# EAGLE design Carte (EAGLE 5.11)
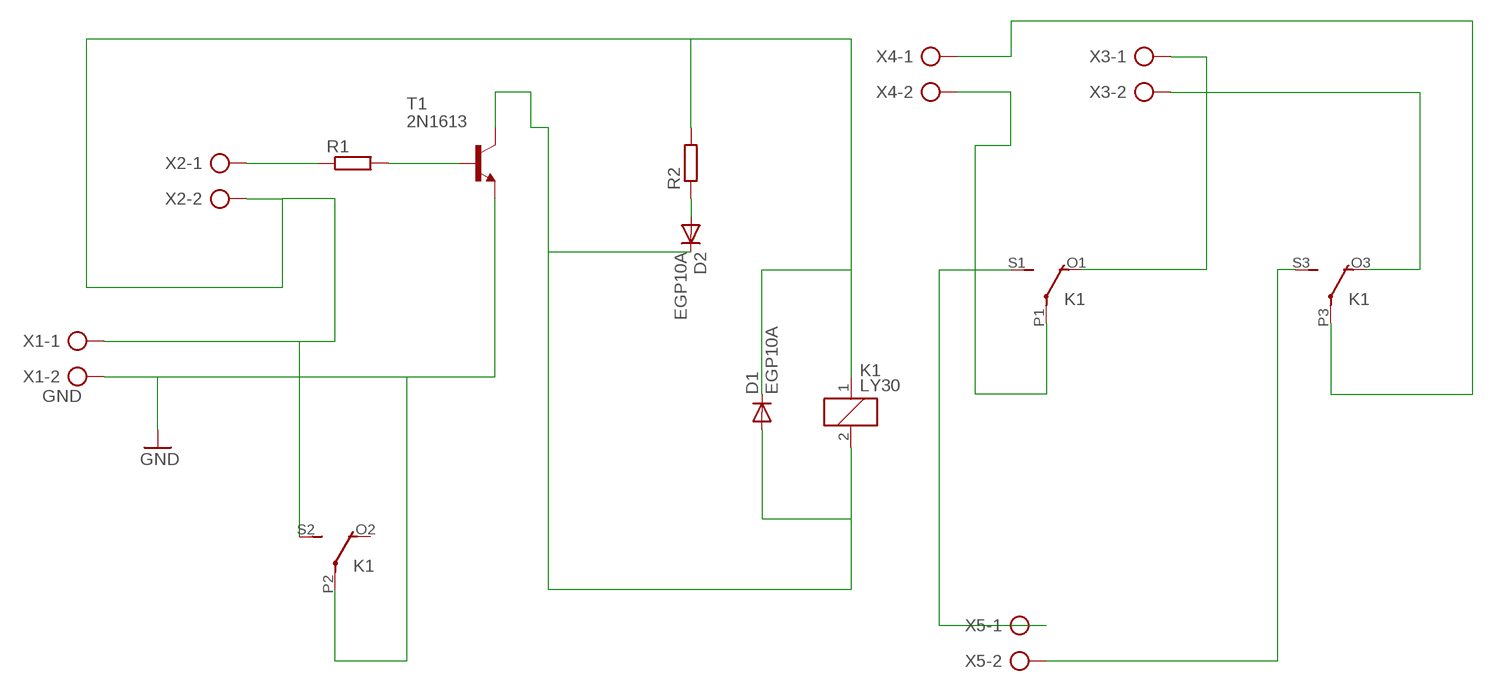
[diagram p0: schematic, sheet 1]

## Parts
D1  EGP10A  [DO41-10]
D2  EGP10A  [DO41-10]
K1  LY30  [LY30]
R1  R-EU_0309/10  [0309/10]
R2  R-EU_0309/10  [0309/10]
T1  2N1613  [TO5]
X1  GND  AK300/2  [AK300/2]
X2  AK300/2  [AK300/2]
X3  AK300/2  [AK300/2]
X4  AK300/2  [AK300/2]
X5  AK300/2  [AK300/2]

## Nets
GND: K1.P2(3:P) T1.1(E) X1.2
N$1: D1.C K1.1 K1.S2(3:S) R2.2 X1.1 X2.2
N$3: R1.1 X2.1
N$4: R1.2 T1.2(B)
N$5: K1.O3(4:O) X3.2
N$6: D2.A R2.1
N$7: K1.S3(4:S) X5.2
N$8: K1.O1(2:O) X3.1
N$9: K1.P1(2:P) X4.2
N$10: D1.A D2.C K1.2 T1.3(C)
N$11: K1.P3(4:P) X4.1
N$12: K1.S1(2:S) X5.1
Unconnected: K1.O2(3:O)

## Library data of the parts
D1 D2 = diode:EGP10A: DIODE ultra fast-recovery rectifier
K1 = Relai ss-marin:LY30: RELAY 3 x switch, Omron; OC_FARNELL: unknown; OC_NEWARK: unknown
R1 R2 = resistor:R-EU_: RESISTOR, European symbol
T1 = transistor:2N1613: NPN TRANSISTOR
X1-X5 = con-ptr500:AK300/2: CONNECTOR; OC_FARNELL: unknown; OC_NEWARK: unknown

## Board
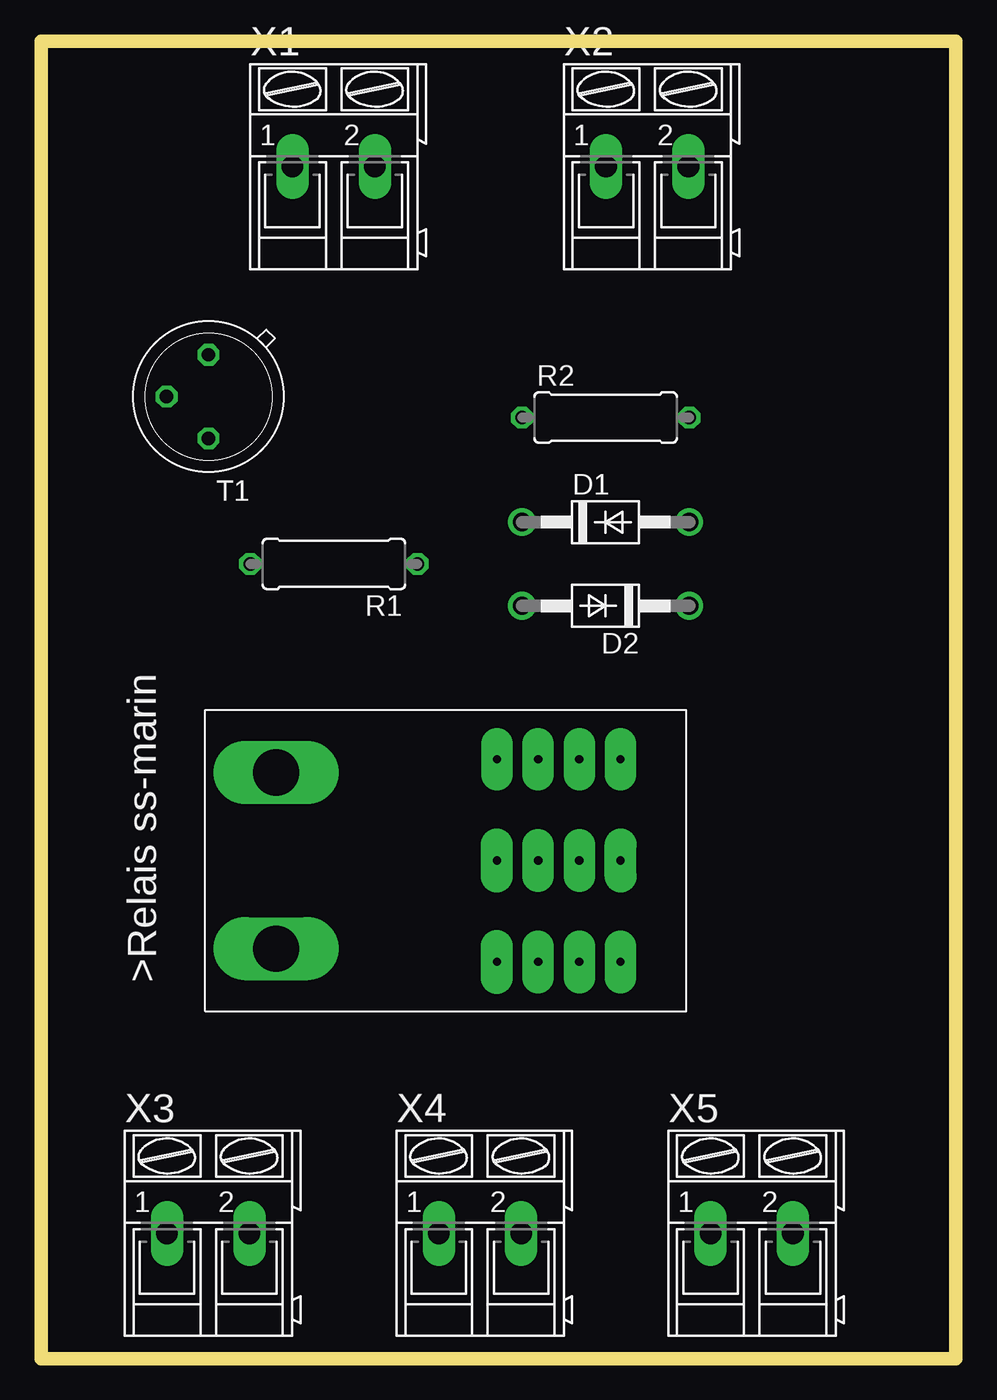
[diagram p1: board, top side]
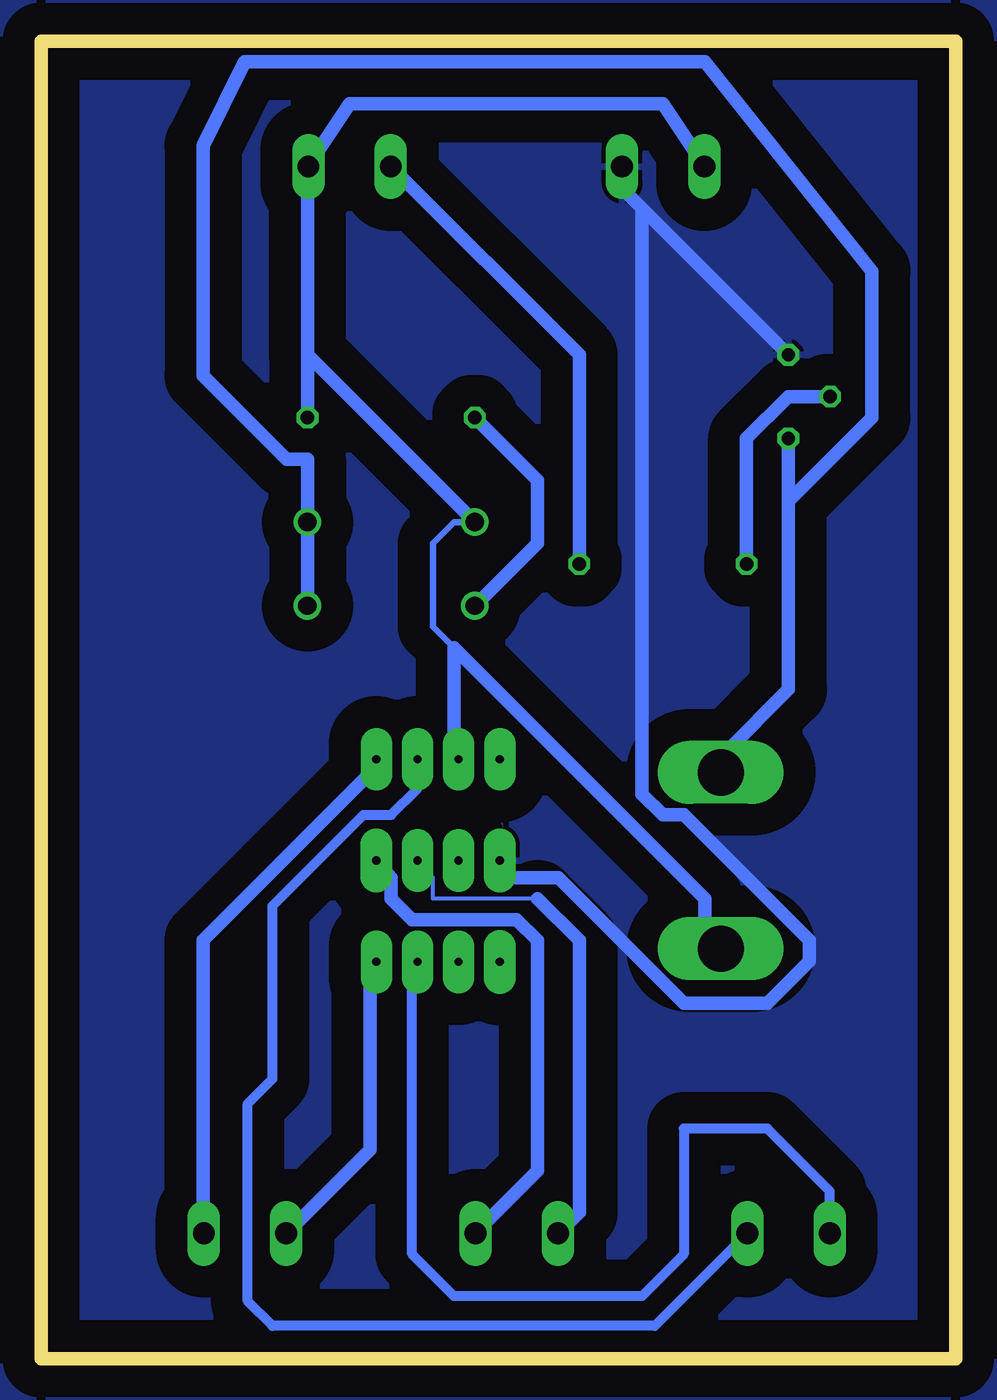
[diagram p2: board, bottom side, seen from below]

Size 55.55 x 80 mm. Coordinates in mm from the lower left corner, seen from the top.
Outline: 0,0 55.55,0 55.55,80 0,80 0,0
Copper layers (1*16): Top 0.035mm / dielectric 1.5mm / Bottom 0.035mm
Design rules "default": minimum track width 10mil, minimum drill 24mil, track to track 8mil, track to pad 8mil, pad to pad 8mil, via to via 8mil, smd to smd 8mil, copper to edge 40mil, drill to drill 8mil, minimum pad ring 10mil, minimum via ring 8mil, stop-mask expansion 4mil, vias tented up to drill 0mil, thermal gap 10mil

### Footprints (pad centres in the part's own frame; a part is rotated, then mirrored left to right if it is on the bottom)
DO41-10 = drill 1.118 round: A 5.08,0; C -5.08,0
LY30 = drill 2.8 pad 2.8 long: 1 -13.2,-0.3; 2 -2.5,-0.3 | drill 0.5 pad 1.9 long: O1 -14,-18.72; O2 -1.7,-13.72; O3 -1.7,-18.72; P3 -7.85,-18.72; P4 -7.85,-16.22; S1 -14,-21.22; S2 -1.7,-16.22; S3 -1.7,-21.22; S4 -14,-16.22 | drill 0.5 pad 1.93 long: O4 -14,-13.72; P1 -7.85,-21.22; P2 -7.85,-13.72
0309/10 = drill 0.813 octagon: 1 -5.08,0; 2 5.08,0
TO5 = drill 0.813 octagon: 1 0,-2.54; 2 2.54,0; 3 0,2.54
AK300/2 = drill 1.321 long: 1 -2.515,0; 2 2.489,0

### Placement (x,y rotation side)
D1  34.29,50.8 0 top
D2  34.29,45.72 180 top
K1  13.97,38.1 90 top
R1  17.78,48.26 180 top
R2  34.29,57.15 0 top
T1  10.16,58.42 180 top
X1  17.78,72.39 0 top
X2  36.83,72.39 0 top
X3  10.16,7.62 0 top
X4  26.67,7.62 0 top
X5  43.18,7.62 0 top

### Tracks (layer width: path | path; a pad name or v marks a point on that pad's centre or on a via)
GND
  Bottom 0.813: 19.05,69.85 20.32,71.12 20.32,72.39 X1.2 | 19.05,69.85 T1.1 | 19.05,69.85 19.05,34.29 17.78,33.02 16.51,33.02 8.89,25.4 8.89,24.13 11.43,21.59 16.51,21.59 24.13,29.21 27.94,29.21 K1.P2
  pour Bottom (isolate 1.93): -2.54,-2.54 58.42,-2.54 58.42,76.2 58.42,82.55 -2.54,82.55
N$1
  Bottom 0.406: D1.C 30.48,50.8 31.75,49.53 31.75,44.45 30.48,43.18
  Bottom 0.813: 39.37,60.96 39.37,72.39 | 39.37,60.96 R2.2 | D1.C 39.37,60.96 | K1.S2 30.48,36.83 30.48,43.18 15.24,27.94 15.24,25.4 K1.1 | 39.37,72.39 36.83,76.2 17.78,76.2 15.24,72.39 X1.1 | 39.37,72.39 X2.2
N$3
  Bottom 0.813: R1.1 22.86,60.96 34.29,72.39 X2.1
N$4
  Bottom 0.813: R1.2 12.7,55.88 10.16,58.42 T1.2
N$5
  Bottom 0.61: K1.O3 32.69,34.62 34.29,33.02 35.98,33.02 41.5,27.5 41.5,17 43,15.5 43,3.5 41.5,2 18.27,2 X3.2
N$6
  Bottom 0.813: D2.A 25.4,49.53 25.4,53.34 R2.1
N$7
  Bottom 0.813: K1.S3 35.56,35.56 45.72,25.4 45.72,7.62 X5.2
N$8
  Bottom 0.61: X3.1 7.64,10.19 11.43,13.97 16.51,13.97 16.51,6.35 19.05,3.81 30.48,3.81 33.02,6.35 33.02,23.77 K1.O1
N$9
  Bottom 0.813: K1.P1 34.29,29.21 34.29,27.94 33.02,26.67 26.67,26.67 25.4,25.4 25.4,11.43 29.21,7.62 X4.2
N$10
  Bottom 0.813: D2.C D1.A 39.37,54.61 40.64,54.61 45.72,59.69 45.72,73.66 43.18,78.74 15.24,78.74 5.08,66.04 5.08,57.15 10.16,52.07 | 10.16,52.07 10.16,40.64 13.97,36.83 K1.2 | 10.16,52.07 T1.3
N$11
  Bottom 0.254: 25.4,27.94 31.75,27.94 31.75,29.21 K1.P3 | X4.1 24.13,7.62
  Bottom 0.813: 24.13,7.62 22.86,8.89 22.86,25.4 25.4,27.94
N$12
  Bottom 0.813: K1.S1 35.56,22.86 35.56,12.7 40.64,7.62 X5.1